# EAGLE design relaisboard (EAGLE 6.5.0)
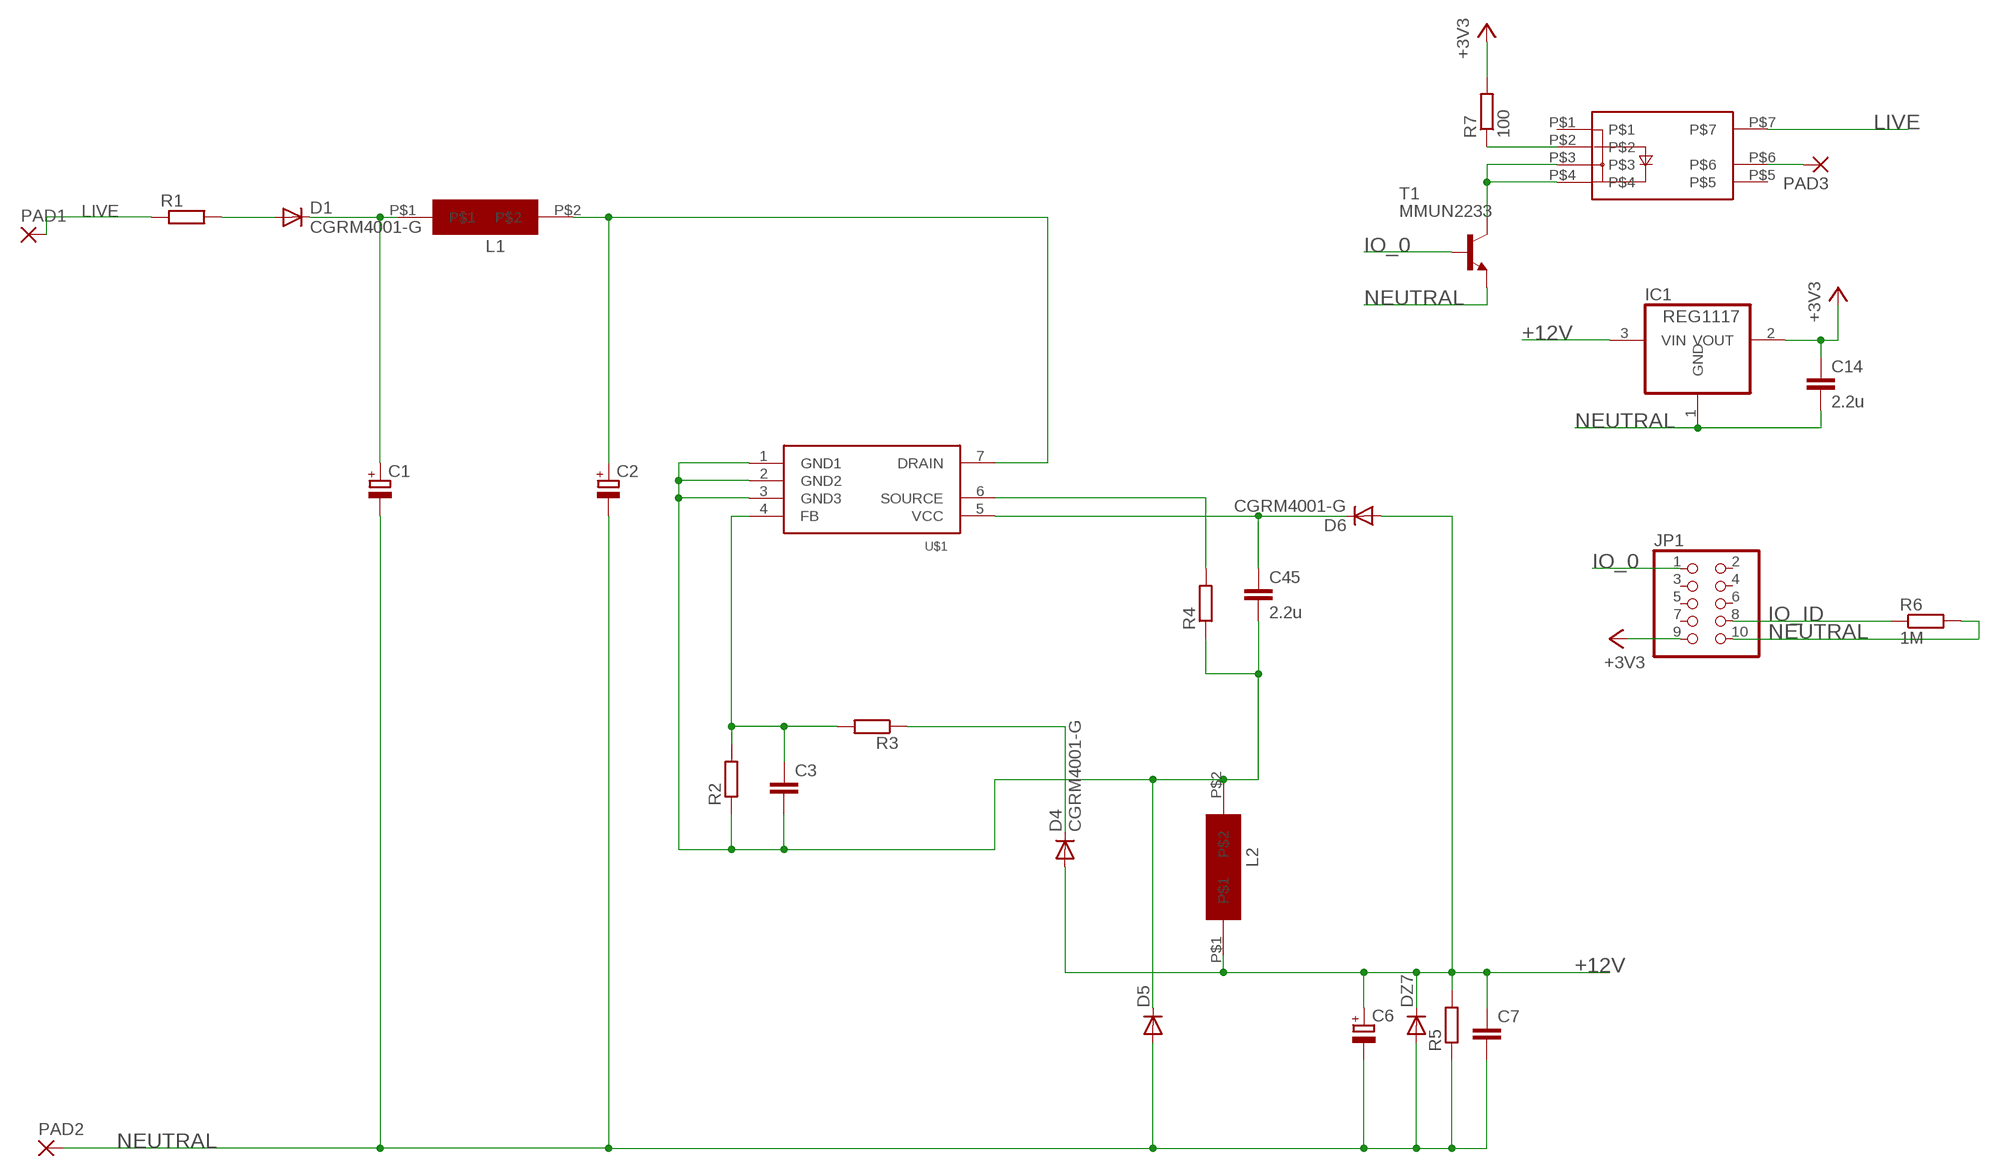
[diagram p0: schematic, sheet 1]

## Parts
C1  CPOL-EUE5-8.5  [E5-8,5]
C2  CPOL-EUE5-8.5  [E5-8,5]
C3  C-EUC0603  [C0603]
C6  CPOL-EUE3.5-8  [E3,5-8]
C7  C-EUC0402  [C0402]
C14  2.2u  C-EUC1206  [C1206]
C45  2.2u  C-EUC1206  [C1206]
D1  CGRM4001-G  [SOD-123_MINI-SMA]
D4  CGRM4001-G  [SOD-123_MINI-SMA]
D5  DIODE-DO-214AC  [DO-214AC]
D6  CGRM4001-G  [SOD-123_MINI-SMA]
DZ7  DIODE-SOD323-R  [SOD323-R]
IC1  REG1117  [SOT223]
JP1  PINHD-2X5  [2X05]
L1  INDUCTOR  [INDUCTOR]
L2  INDUCTOR  [INDUCTOR]
PAD1  2,15/1,0  [2,15/1,0]
PAD2  2,15/1,0  [2,15/1,0]
PAD3  2,15/1,0  [2,15/1,0]
R1  R-EU_0207/2V  [0207/2V]
R2  R-EU_R0402  [R0402]
R3  R-EU_R0402  [R0402]
R4  R-EU_R1206  [R1206]
R5  R-EU_R0603  [R0603]
R6  1M  R-EU_R0402  [R0402]
R7  100  R-EU_R0402  [R0402]
T1  MMUN2233  BC817-16-NPN-SOT23-BEC  [SOT23-BEC]
U$1  TEA1721  [SO7]
U$2  PR3BMF51  [DIP7]

## Nets
+3V3: C14.1 IC1.2(VOUT) JP1.9 R7.2
+12V: C6.+ C7.1 D4.A D6.A DZ7.C IC1.3(VIN) L2.P$1 R5.2
IO_0: JP1.1 T1.B
IO_ID: JP1.8 R6.1
LIVE: PAD1.1(P) R1.1 U$2.P$7
N$1: D1.A R1.2
N$2: C1.+ D1.C L1.P$1
N$3: C2.+ L1.P$2 U$1.7(DRAIN)
N$4: PAD3.1(P) U$2.P$6
N$5: R7.1 U$2.P$2
N$6: T1.C U$2.P$3 U$2.P$4
N$7: C45.1 D6.C U$1.5(VCC)
N$8: R4.2 U$1.6(SOURCE)
N$9: C3.2 C45.2 D5.C L2.P$2 R2.1 R4.1 U$1.1(GND1) U$1.2(GND2) U$1.3(GND3)
N$10: D4.C R3.1
N$11: C3.1 R2.2 R3.2 U$1.4(FB)
NEUTRAL: C1.- C2.- C6.- C7.2 C14.2 D5.A DZ7.A IC1.1(GND) JP1.10 PAD2.1(P) R5.1 R6.2 T1.E
Unconnected: JP1.2 JP1.3 JP1.4 JP1.5 JP1.6 JP1.7 U$2.P$1 U$2.P$5

## Library data of the parts
C1 C2 = rcl:CPOL-EU: POLARIZED CAPACITOR, European symbol; DIGIKEY: 1189-1633-1-ND
C3 = rcl:C-EU: CAPACITOR, European symbol; DIGIKEY: 399-8979-1-ND
C6 = rcl:CPOL-EU: POLARIZED CAPACITOR, European symbol; DIGIKEY: 493-1043-ND
C7 = rcl:C-EU: CAPACITOR, European symbol; DIGIKEY: 1276-1028-1-ND
C14 C45 = rcl:C-EU: CAPACITOR, European symbol; DIGIKEY: 1276-2723-1-ND
D1 = diode:CGRM400*-G: Molded plasitc,JEDEC SOD-123/Mini SMA Source: Comchip CGRM4001-G.pdf; REICHELT: S 1ML SMD
D4 D6 = diode:CGRM400*-G: Molded plasitc,JEDEC SOD-123/Mini SMA Source: Comchip CGRM4001-G.pdf; REICHELT: ES 1JL SMD
D5 = diode:DIODE-: DIODE; DIGIKEY: BYG20J-E3/TRGICT-ND
DZ7 = diode:DIODE-: DIODE; DIGIKEY: 568-3810-1-ND
IC1 = burr-brown:REG1117: 800mA and 1A Low Dropout (LDO) Positive Regulator 1.8V, 2.5V, 2.85V, 3.3V, 5V, and Adj; DIGIKEY: AP1117IE33G-13DICT-ND; MPN: REG1117; OC_FARNELL: 1097566; OC_NEWARK: 14P6981
JP1 = pinhead:PINHD-2X5: PIN HEADER
L1 = fastron_pisg_inductors:INDUCTOR; REICHELT: L-PISG 1,0M
L2 = fastron_pisg_inductors:INDUCTOR; REICHELT: L-PISR 1,0M
PAD1-PAD3 = wirepad:2,15/1,0: THROUGH-HOLE PAD
R1 = rcl:R-EU_: RESISTOR, European symbol; DIGIKEY: CF14JT47R0CT-ND
R2 = rcl:R-EU_: RESISTOR, European symbol; DIGIKEY: 1276-3466-1-ND
R3 = rcl:R-EU_: RESISTOR, European symbol; DIGIKEY: RHM18KCDCT-ND
R4 = rcl:R-EU_: RESISTOR, European symbol; DIGIKEY: 311-1.0ERCT-ND
R5 = rcl:R-EU_: RESISTOR, European symbol; DIGIKEY: 311-68KGRCT-ND
R6 = rcl:R-EU_: RESISTOR, European symbol; DIGIKEY: 311-1.00MLRCT-ND
R7 = rcl:R-EU_: RESISTOR, European symbol; DIGIKEY: 311-100JRCT-ND
T1 = transistor:*-NPN-: NPN Transistror BF959 corrected 2008.03.06; DIGIKEY: MMUN2233LT1GOSCT-ND
U$1 = tea1721:TEA1721; DIGIKEY: 568-9556-1-ND
U$2 = pr3bmf51_relais:PR3BMF51; DIGIKEY: 425-2562-5-ND

## Board
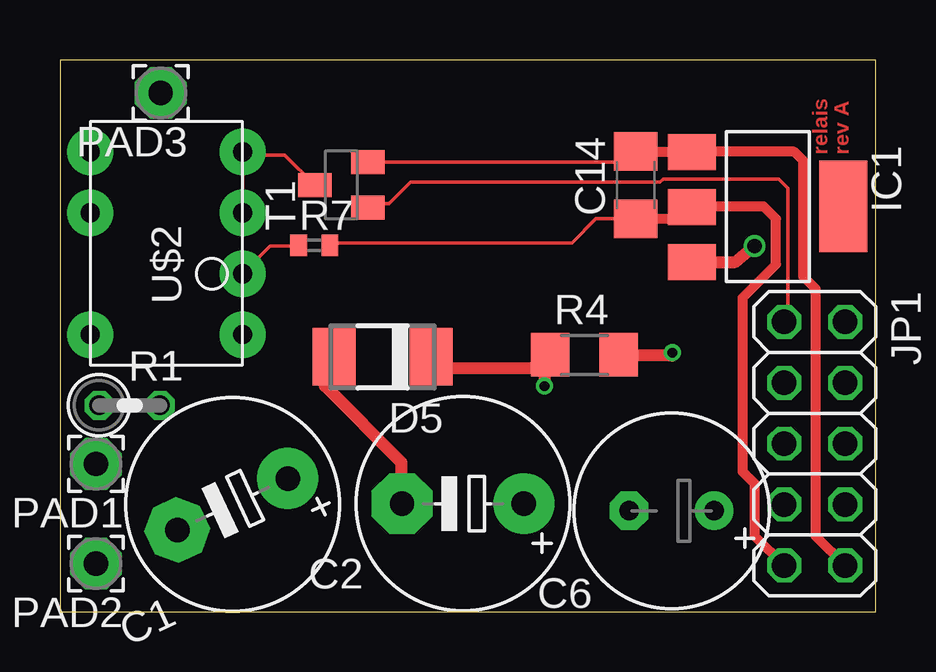
[diagram p1: board, top side]
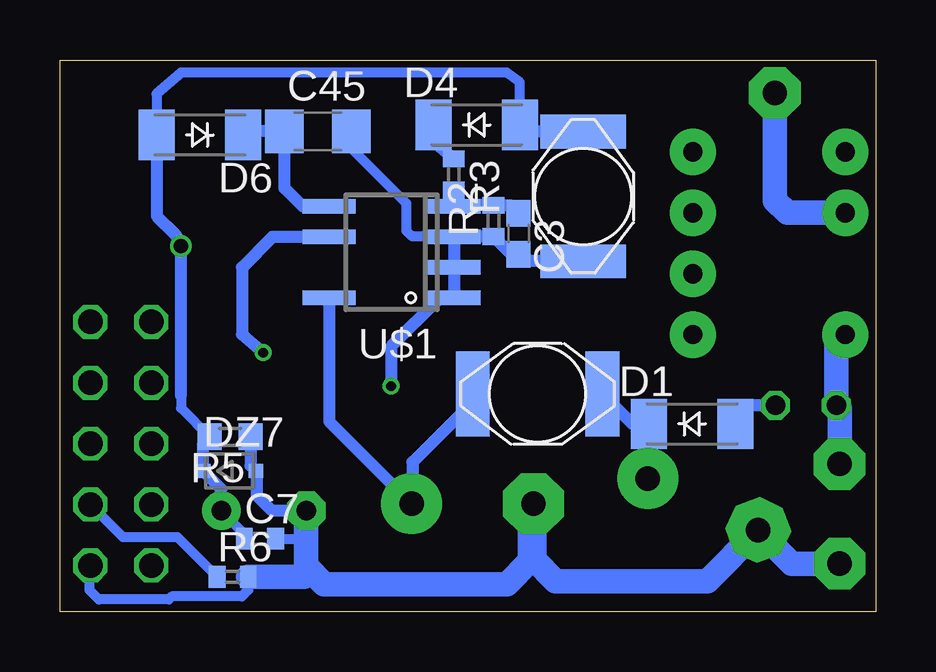
[diagram p2: board, bottom side, seen from below]

Size 34 x 23 mm. Coordinates in mm from the lower left corner, seen from the top.
Outline: 0,0 34,0 34,23 0,23 0,0
Copper layers (1*16): Top 0.035mm / dielectric 1.5mm / Bottom 0.035mm
Design rules "PCB-POOL Standard": minimum track width 0.15mm, minimum drill 0.3mm, track to track 0.15mm, track to pad 0.15mm, pad to pad 0.15mm, via to via 0.15mm, smd to smd 0.15mm, copper to edge 0.3mm, drill to drill 0.2mm, minimum pad ring 0.2mm, minimum via ring 0.15mm, stop-mask expansion 0.075mm, vias tented up to drill 0mil, thermal gap 0.2mm

### Footprints (pad centres in the part's own frame; a part is rotated, then mirrored left to right if it is on the bottom)
E5-8,5 = drill 1.016 pad 2.54: + -2.54,0 | drill 1.016 pad 2.54 octagon: - 2.54,0
C0603 = smd 1.1 x 1: 1 -0.85,0; 2 0.85,0
E3,5-8 = drill 0.813 pad 1.6: + -1.778,0 | drill 0.813 pad 1.6 octagon: - 1.778,0
C0402 = smd 0.7 x 0.9: 1 -0.65,0; 2 0.65,0
C1206 = smd 1.6 x 1.8: 1 -1.4,0; 2 1.4,0
SOD-123_MINI-SMA = smd 1.5 x 2.1: A 1.8,0; C -1.8,0
DO-214AC = smd 1.8 x 2.4: A 2.025,0; C -2.025,0
SOD323-R = smd 0.6 x 0.6: A 1.1,0; C -1.1,0
SOT223 = smd 1.499 x 2.007: 1 -2.261,-3.15; 2 0.025,-3.15; 3 2.311,-3.15 | smd 3.81 x 2.007: 4 0,3.15
2X05 = drill 1.016 octagon: 1 -5.08,-1.27; 2 -5.08,1.27; 3 -2.54,-1.27; 4 -2.54,1.27; 5 0,-1.27; 6 0,1.27; 7 2.54,-1.27; 8 2.54,1.27; 9 5.08,-1.27; 10 5.08,1.27
INDUCTOR = smd 1.4 x 3.56: P$1 -2.7,0; P$2 2.7,0
2,15/1,0 = drill 1.016 pad 2.159 octagon: 1 0,0
0207/2V = drill 0.813 octagon: 1 -1.27,0; 2 1.27,0
R0402 = smd 0.7 x 0.9: 1 -0.65,0; 2 0.65,0
R1206 = smd 1.6 x 1.803: 1 -1.422,0; 2 1.422,0
R0603 = smd 1 x 1.1: 1 -0.85,0; 2 0.85,0
SOT23-BEC = smd 1 x 1.4: B -0.95,-1.1; C 0,1.1; E 0.95,-1.1
SO7 = smd 0.6 x 2.2: 1 -2.375,-2.56; 2 -1.105,-2.56; 3 0.165,-2.56; 4 1.435,-2.56; 5 1.435,2.64; 6 0.165,2.64; 7 -2.375,2.64
DIP7 = drill 0.8 pad 1.93: P$1 -5.08,-2.54; P$2 -2.54,-2.54; P$3 0,-2.54; P$4 2.54,-2.54; P$5 2.54,3.81; P$6 0,3.81; P$7 -5.08,3.81

### Placement (x,y rotation side)
C1  7.19,4.47 205 top
C2  16.8,4.5 180 top
C3  14.88,15.75 270 bottom
C6  25.5,4.2 180 top
C7  25.66,3.04 0 bottom
C14  24,17.78 90 top
C45  23.25,20.02 0 bottom
D1  7.65,7.83 0 bottom
D4  16.63,20.29 0 bottom
D5  13.45,10.62 180 top
D6  28.16,19.87 180 bottom
DZ7  26.93,5.86 0 bottom
IC1  29.5,16.89 270 top
JP1  31.46,7 270 top
L1  14.09,9.07 180 bottom
L2  12.19,17.31 270 bottom
PAD1  1.5,6.15 180 top
PAD2  1.5,2 180 top
PAD3  4.2,21.63 180 top
R1  2.9,8.6 0 top
R2  15.93,16.29 90 bottom
R3  17.58,18.23 270 bottom
R4  21.87,10.7 0 top
R5  26.91,7.28 180 bottom
R6  26.8,1.45 0 bottom
R7  10.6,15.27 0 top
T1  11.73,17.79 90 top
U$1  20.14,15.46 90 bottom
U$2  5.07,16.63 90 top

### Tracks (layer width: path | path; a pad name or v marks a point on that pad's centre or on a via)
+3V3
  Top 0.152: R7.2 11.35,15.37 21.34,15.37 22.35,16.38 C14.1
  Top 0.406: JP1.9 28.96,3.15 28.96,5.33 28.45,5.84 28.45,13.08 29.84,14.48 29.84,16.38 29.34,16.89 26.38,16.89 IC1.2 25.87,16.38 C14.1
+12V  (via drill 0.6)
  Top 0.508: IC1.3 28.16,14.58 v28.96,15.24
  Bottom 0.254: 29.97,19.38 D6.A
  Bottom 0.406: C7.1 26.44,3.36 C6.+ | 28.96,9.02 28.96,8.48 R5.2 | 14.83,20.01 14.83,22.07 15.37,22.48 28.96,22.48 29.97,21.59 29.97,19.38
  Bottom 0.508: 29.08,15.24 v28.96,15.24 | v28.96,15.24 29.2,15.74 29.96,16.5 D6.A 29.84,19.48 | L2.P$1 14.83,20.01 D4.A | 28.96,9.02 v28.96,15.24 | C6.+ 27.28,5.11 DZ7.C 28.03,7.01 R5.2
IO_0
  Top 0.152: JP1.1 30.35,12.24 30.35,17.65 29.97,18.03 25.15,18.03 25.02,17.91 14.61,17.91 13.72,17.02 13.01,17.02 T1.B 12.88,16.89
IO_ID
  Bottom 0.406: R6.1 27.7,1.7 29.1,3.1 31.37,3.1 JP1.8
LIVE
  Bottom 1.016: PAD1.1 1.5,8.47 R1.1 1.63,11.18 U$2.P$7
N$1
  Bottom 0.508: R1.2 5.46,8.6 D1.A
N$2
  Bottom 0.508: L1.P$1 10.14,7.83 D1.C 9.45,5.59 C1.+
N$3
  Bottom 0.508: L1.P$2 16.79,8.74 19.3,6.22 19.3,4.54 C2.+ 22.78,7.94 U$1.7
N$4
  Bottom 1.016: PAD3.1 4.19,21.49 4.19,17.14 3.68,16.64 1.27,16.64 U$2.P$6
N$5
  Top 0.152: R7.1 9.92,15.24 8.77,15.24 U$2.P$2
N$6
  Top 0.152: T1.C 9.37,19.04 7.74,19.04 U$2.P$4 U$2.P$3
N$7
  Bottom 0.508: 24.64,19.91 C45.1 | C45.1 26.34,20.02 D6.C | U$1.5 23.88,16.89 24.64,17.65 24.64,20.01 C45.1
N$8  (via drill 0.41)
  Top 0.508: v25.53,10.79 25.53,10.67 23.32,10.67 R4.2
  Bottom 0.508: U$1.6 25.15,15.62 26.42,14.35 26.42,11.56 v25.53,10.79
N$9  (via drill 0.41)
  Top 0.508: D5.C 15.3,10.16 19.9,10.16 R4.1 20.44,10.66 20.19,10.41 | 20.19,10.41 20.19,10.54 | 20.19,10.41 v20.19,9.4
  Bottom 0.406: 17.56,15.64 19.32,15.64 19.56,15.88 19.56,17.02 21.84,19.3 C45.2
  Bottom 0.508: L2.P$2 14.59,14.61 C3.2 15.19,14.9 R2.1 17.56,15.64 U$1.3 U$1.2 U$1.1 18.16,13.08 20.19,11.05 v20.19,9.4
N$10
  Bottom 0.508: D4.C 18.35,19.53 R3.1
N$11
  Bottom 0.508: 17.53,16.94 R2.2 15.22,16.94 C3.1 | 17.53,16.94 U$1.4 | 17.53,16.94 17.53,17.25 R3.2
NEUTRAL
  Top 0.152: 23.36,18.54 C14.2 | T1.E 23.56,18.74
  Top 0.406: JP1.10 31.5,3.15 31.5,13.46 30.99,13.97 30.99,18.8 30.61,19.18 26.38,19.18 IC1.1 26.32,19.18 C14.2 23.56,18.74
  Top 0.508: D5.A 11.04,9.4 14.22,6.22 14.22,4.54 C2.-
  Bottom 0.406: 14.06,4.7 C2.- 14.4,4.64 | R6.2 26.15,0.9 26.42,0.64 29.34,0.64 29.46,0.51 32.38,0.51 32.77,0.89 32.77,1.88 JP1.10 | C7.2 23.62,3.04 23.75,2.54
  Bottom 0.508: R5.1 26.06,6.09 DZ7.A 25.78,5.82 25.78,4.83 25.16,4.2 C6.-
  Bottom 1.016: C2.- 14.22,4.46 14.22,2.16 13.34,1.27 7.02,1.27 C1.- 3.49,2 PAD2.1 | 14.4,4.64 14.4,2.11 15.37,1.14 22.99,1.14 23.75,1.91 | 23.75,1.91 23.75,2.54 23.75,4.17 C6.- | R6.2 23.83,1.45 23.75,1.91

### Text on the board
Top: relais | rev A
tDocu: FEMALE / BOTTOM